# Altium schematic sheet Usb_to_i2c.schdoc: USB I2C
size 594 x 420 mm; Date: 28/10/2018; ApprovedBy: Королев; CheckedBy: Капустин; DrawnBy: Хомутов; Organization: ЦНИИ РТК; DocumentNumber: МК.111801.001 Э3; Revision: Королев; SheetTotal: 1; Title1str: Преобразователь; DocumentType: Схема электрическая принципиальная; Format: A3; ImagePath: Введите номер платы
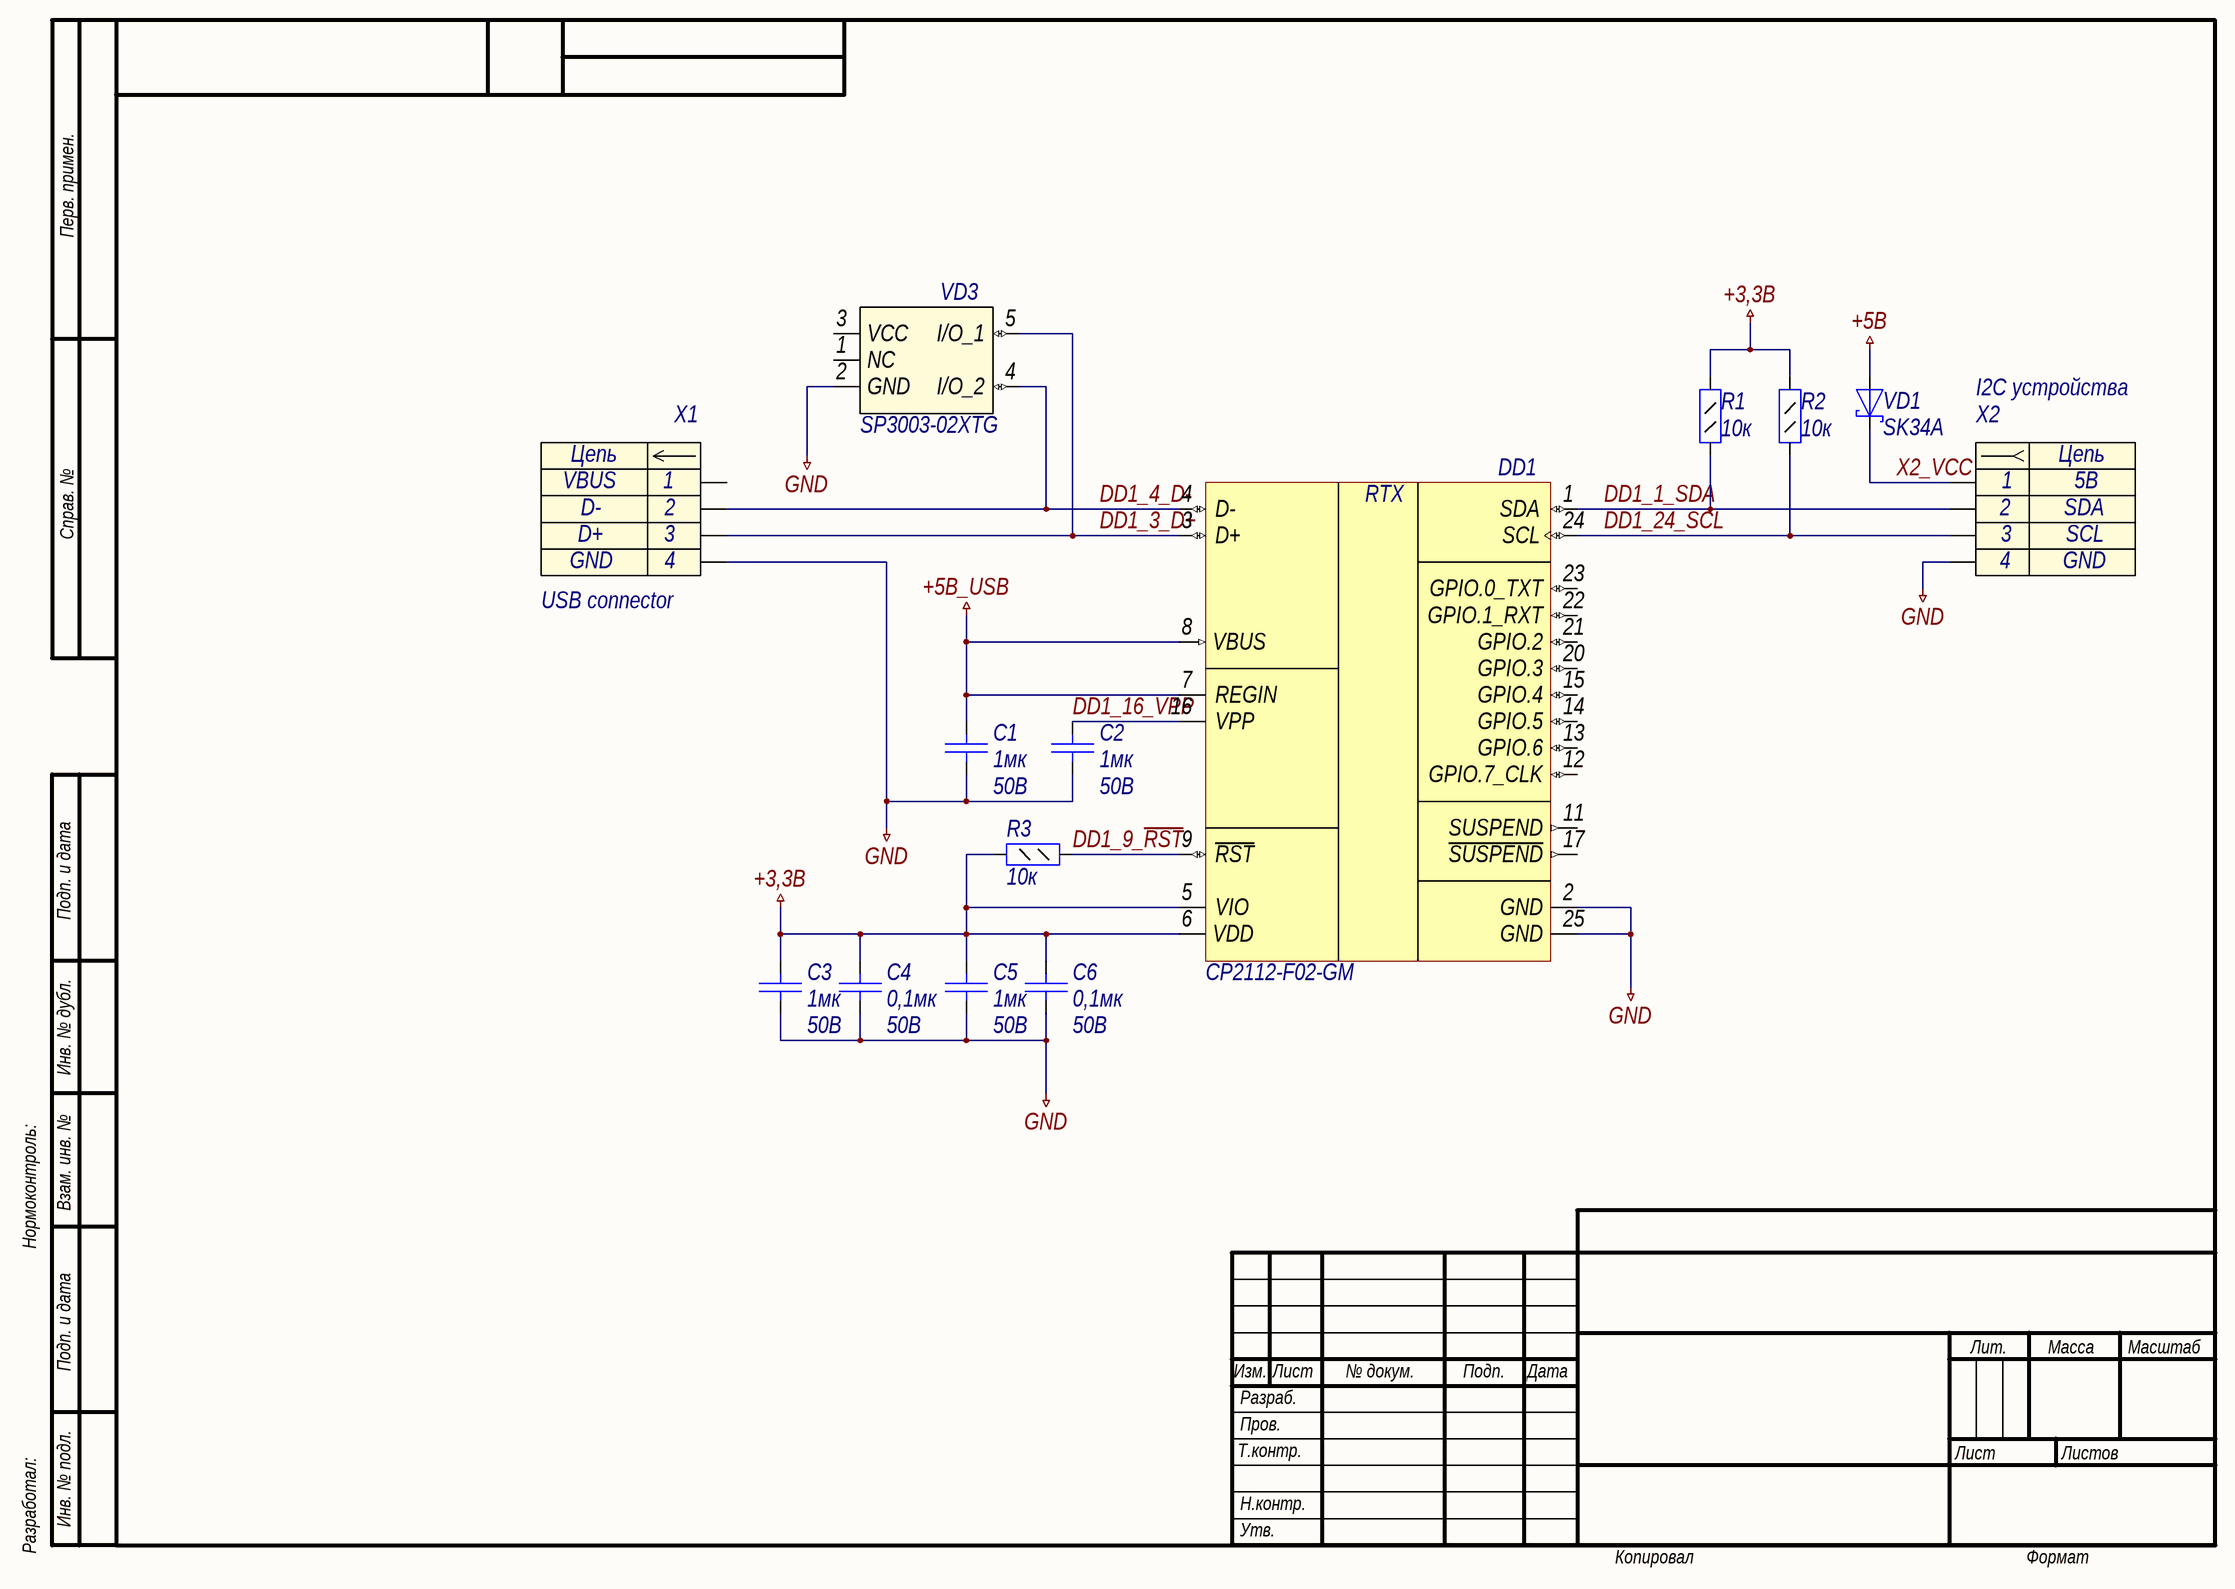
[diagram p0: Usb_to_i2c.schdoc]

## Parts
C1  value 1мк  Voltage: 50B  [C0603]  (hidden comment: Capacitor)
C2  value 1мк  Voltage: 50B  [C0603]  (hidden comment: Capacitor)
C3  value 1мк  Voltage: 50B  [C0603]  (hidden comment: Capacitor)
C4  value 0,1мк  Voltage: 50B  [C0603]  (hidden comment: Capacitor)
C5  value 1мк  Voltage: 50B  [C0603]  (hidden comment: Capacitor)
C6  value 0,1мк  Voltage: 50B  [C0603]  (hidden comment: Capacitor)
DD1  CP2112-F02-GM  [QFN24]
R1  value 10к  [R0805]  (hidden comment: Resistor_0,125Вт)
R2  value 10к  [R0805]  (hidden comment: Resistor_0,125Вт)
R3  value 10к  [R0805]  (hidden comment: Resistor_0,125Вт)
VD1  Part Number: SK34A  [SMA]  (hidden comment: DiodeSchottky)
VD3  SP3003-02XTG  [SOT553]
X1  USB connector  [USB 2.0 A PLUG]
X2  Part Name: I2C устройства  [PLS-4HOLES]  (hidden comment: Header_4_sct)

## Nets
+3,3В: C3.2 C4.2 C5.2 C6.2 DD1.5(VIO) DD1.6(VDD) R1.2 R2.2 R3.2
+5В: VD1.2(A)
+5В_USB: C1.2 DD1.7(REGIN) DD1.8(VBUS)
GND: C1.1 C2.1 C3.1 C4.1 C5.1 C6.1 DD1.2(GND) DD1.25(GND) VD3.2(GND) X1.4 X2.4
DD1_1_SDA: DD1.1(SDA) R1.1 X2.2
DD1_3_D+: DD1.3(D+) VD3.5(I/O_1) X1.3
DD1_4_D-: DD1.4(D-) VD3.4(I/O_2) X1.2
DD1_9_~{RST}: DD1.9(~{RST}) R3.1
DD1_16_VPP: C2.2 DD1.16(VPP)
DD1_24_SCL: DD1.24(SCL) R2.1 X2.3
X2_VCC: VD1.1(K) X2.1

Not connected (* = marked no-connect by the designer): DD1 11(SUSPEND) 12(GPIO.7_CLK) 13(GPIO.6) 14(GPIO.5) 15(GPIO.4) 17(~{SUSPEND}) 20(GPIO.3) 21(GPIO.2) 22(GPIO.1_RXT) 23(GPIO.0_TXT); VD3 1(NC) 3(VCC); X1 1

## Notes on the sheet
- Перв. примен.
- Справ. №
- Подп. и дата
- Инв. № дубл.
- Нормоконтроль:
- Взам. инв. №
- Изм.
- Лист
- № докум.
- Подп.
- Дата
- Лит.
- Масса
- Масштаб
- Т.контр.
- Пров.
- Разраб.
- Листов
- Разработал:
- Инв. № подл.
- Н.контр.
- Утв.
- Копировал
- Формат
- (in symbol connect10) Цепь
- (in symbol connect36) Цепь
- (in symbol interf14) RTX

## Library data of the parts
C1-C3 C5 = cap134: Конденсатор; Part Name: Capacitors; Part Number: GRM188R71C105KA12D**; id: cap134; TKE: X7R
C4 C6 = cap131: Конденсатор; Part Name: Capacitors; Part Number: GRM188R71H104K; id: cap131; TKE: X7R
DD1 = interf14: USB-I2C преобразователь; Part Name: HID USB to SMBUS Bridge; Manufacture: Silicon Laboratories; Vref output: 3.45V; Type Supply: Single Polar; Current Consumption: 15mA; Power Supply: 3.0-3.6V; id: interf14; Part Number: CP2112-F02-GM
R1-R3 = res97: Резистор; Manufacture: Yageo; Part Number: RC0805FR-0710KL; id: res97; Accuracy: 1%; Part Name: Resistor; Power: 0,125Вт
VD1 = diode2: Диод Шоттки; Manufacture: Taiwan Semiconductor; id: diode2; Reverse Voltage: 40B; Forward Voltage: 0,55B; Forward Current: 3A; Part Name: Diode Schottky
VD3 = diode14: Двухканальная ESD защита USB; Part Name: ESD Suppression Diodes for USB; Manufacture: Littelfuse; Reverse Voltage: 6В; Leakage current: 0,5uA; Capacitance: 0,65pF; Number of Channels: 2; id: diode14; Breakdown Voltage: 6В; Part Number: SP3003-02XTG
X1 = connect36: Разъем - 4 конт. вилка; Part Name: USB 2.0 type A plug 4 pin Horizontal TH; Part Number: UP2-AH-1-TH; Manufacture: CUI; Contact_1: VBUS; Contact_2: D-; Contact_3: D+; Contact_4: GND; id: connect36
X2 = connect10: Разъем - 4 конт. розетка; Contact_1: 5В; Contact_2: SDA; Contact_3: SCL; Contact_4: GND; id: connect10